# Altium schematic sheet DC_DC_MPPT.SchDoc
size A4; SheetNumber: 3; SheetTotal: 9
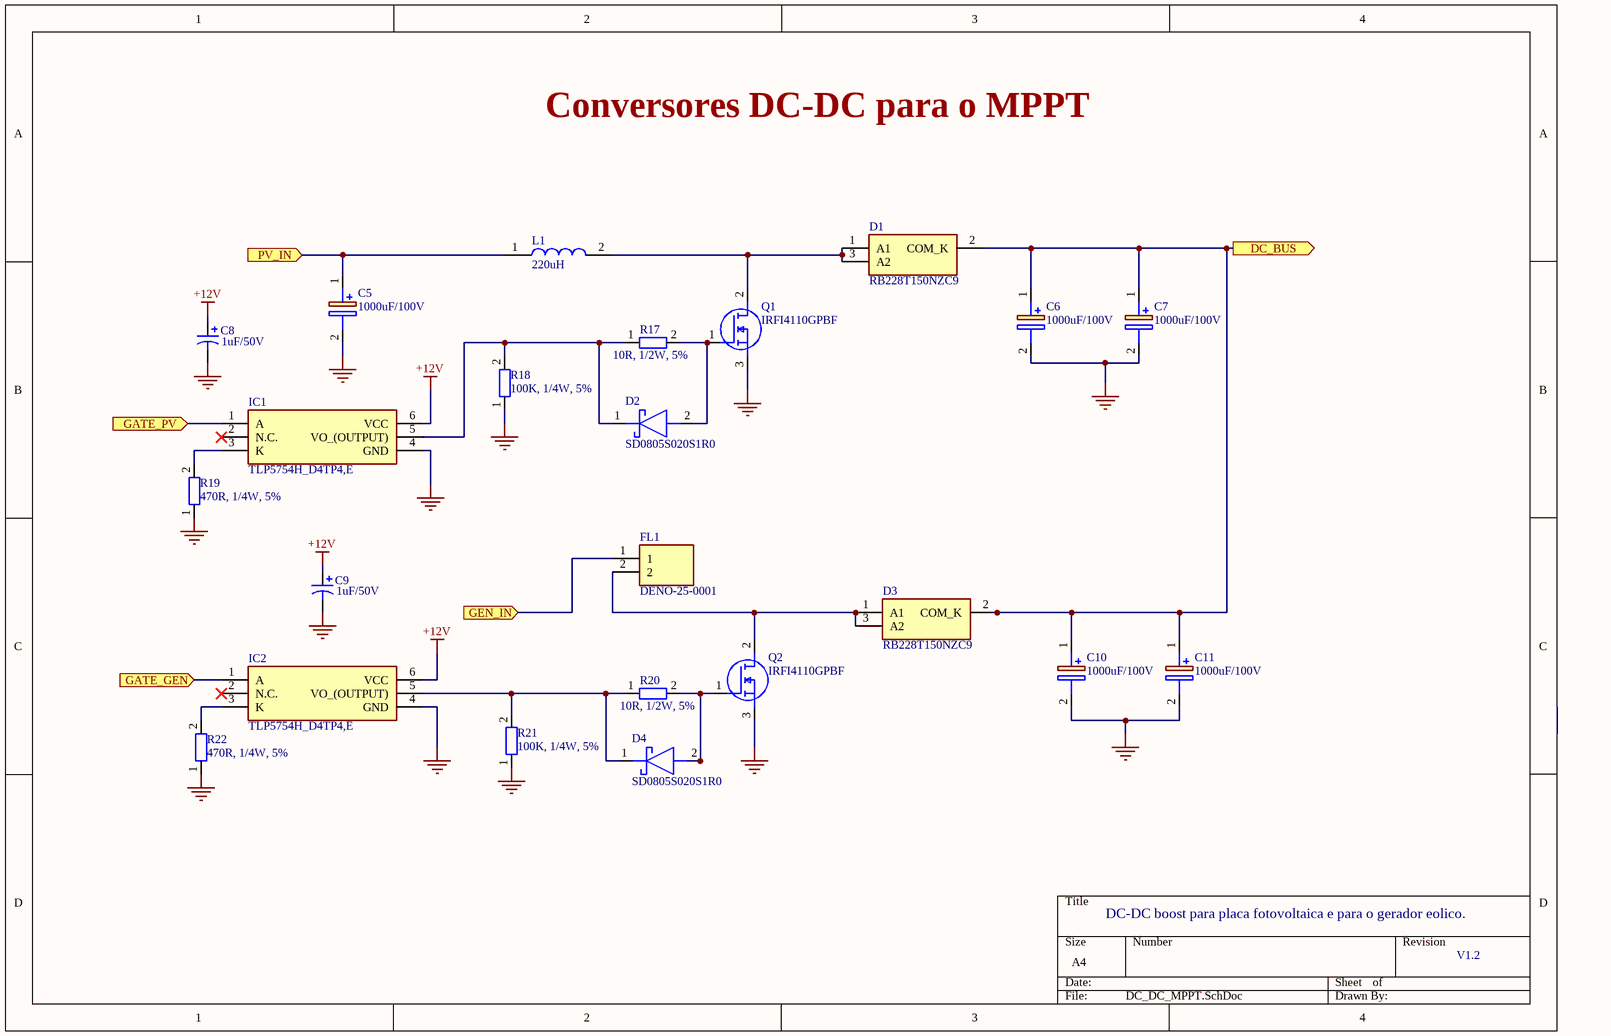
[diagram p0: DC_DC_MPPT.SchDoc]

## Parts
C5  1000uF/100V  [CAPPRD750W85D1800H3750]
C6  1000uF/100V  [CAPPRD750W85D1800H3750]
C7  1000uF/100V  [CAPPRD750W85D1800H3750]
C8  value 1uF/50V  [C1206]  (hidden comment: Cap Pol1)
C9  value 1uF/50V  [C1206]  (hidden comment: Cap Pol1)
C10  1000uF/100V  [CAPPRD750W85D1800H3750]
C11  1000uF/100V  [CAPPRD750W85D1800H3750]
D1  RB228T150NZC9  [TO254P480X1010X2100-3P]
D2  SD0805S020S1R0  [DIOM1613X100N]
D3  RB228T150NZC9  [TO254P480X1010X2100-3P]
D4  SD0805S020S1R0  [DIOM1613X100N]
FL1  DENO-25-0001  [DENO250001]
IC1  TLP5754H_D4TP4,E  [SOIC127P1105X230-6N]
IC2  TLP5754H_D4TP4,E  [SOIC127P1105X230-6N]
L1  220uH  [1140221KRC]
Q1  IRFI4110GPBF  [TO254P483X1018X2095-3P]
Q2  IRFI4110GPBF  [TO254P483X1018X2095-3P]
R17  10R, 1/2W, 5%  [RESC3216X60N]
R18  100K, 1/4W, 5%  [RES-0805]
R19  470R, 1/4W, 5%  [RES-0805]
R20  10R, 1/2W, 5%  [RESC3216X60N]
R21  100K, 1/4W, 5%  [RES-0805]
R22  470R, 1/4W, 5%  [RES-0805]

## Ports
DC_BUS (out), GATE_GEN (in), GATE_PV (in), GEN_IN (in), PV_IN (in)

## Nets
+12V: C8.1 C9.1 IC1.6(VCC) IC2.6(VCC)
GND: C5.2(-) C6.2(-) C7.2(-) C8.2 C9.2 C10.2(-) C11.2(-) IC1.4(GND) IC2.4(GND) Q1.3(S) Q2.3(S) R18.1 R19.1 R21.1 R22.1
DC_BUS: C6.1(+) C7.1(+) C10.1(+) C11.1(+) D1.2(COM_K) D3.2(COM_K) ; port DC_BUS
GATE_GEN: IC2.1(A) ; port GATE_GEN
GATE_PV: IC1.1(A) ; port GATE_PV
GEN_IN: FL1.1 ; port GEN_IN
PV_IN: C5.1(+) L1.1 ; port PV_IN
NetD1_1: D1.1(A1) D1.3(A2) L1.2 Q1.2(D)
NetD2_1: D2.1(K) IC1.5(VO_(OUTPUT)) R17.1 R18.2
NetD2_2: D2.2(A) Q1.1(G) R17.2
NetD3_1: D3.1(A1) D3.3(A2) FL1.2 Q2.2(D)
NetD4_1: D4.1(K) IC2.5(VO_(OUTPUT)) R20.1 R21.2
NetD4_2: D4.2(A) Q2.1(G) R20.2
NetIC1_3: IC1.3(K) R19.2
NetIC2_3: IC2.3(K) R22.2

Not connected (* = marked no-connect by the designer): IC1 2(N.C.)*; IC2 2(N.C.)*

## Notes on the sheet
- Conversores DC-DC para o MPPT
- DC-DC boost para placa fotovoltaica e para o gerador eolico.
- V1.2

## Library data of the parts
C5-C7 C10 C11 = ECA-2AHG102: Aluminum Electrolytic Capacitors - Leaded 1000uF 100V; Manufacturer_Name: Panasonic; Capacitance: 1mF; Tolerance: 20%; Ripple Current: 985mA; Leakage Current: 3uA; Life (Hours): 2000Hour; Dissipation Factor: 0.08%; Lead/Base Style: Straight; Lead Diameter: 0.8mm; Datasheet Link: http://www.mouser.com/ds/2/315/ABA0000C1215-1109177.pdf; Height: 37.5mm; Manufacturer_Part_Number: ECA-2AHG102; Mouser Part Number: 667-ECA-2AHG102; Mouser Price/Stock: https://www.mouser.co.uk/ProductDetail/Panasonic/ECA-2AHG102/?qs=rrcJgg%2Fw9KxYcZZHtVYgiQ%3D%3D; Arrow Part Number: ECA-2AHG102; Arrow Price/Stock: https://www.arrow.com/en/products/eca-2ahg102/panasonic; Supplier 1: Mouser; Supplier Part Number 1: 667-ECA-2AHG102; Manufacturer: Panasonic; Manufacturer Part Number: ECA-2AHG102; RoHS: Yes; Category: Aluminum Electrolytic Capacitors; Stock 1: 994; Pricing 1: 1=2.62000, 10=1.75000, 50=1.75000, 100=1.60000, 1000=1.07000, 10000=1.07000 (USD); Mount: Through Hole,PCB; Case/Package: Radial; Number of Pins: 2; Contact Plating: Tin; Min Operating Temperature: -55°C; Max Operating Temperature: 105°C; Termination: Radial; Voltage Rating: 100V; Packaging: Bulk; Package Quantity: 50; Voltage Rating (DC): 100V; Voltage: 100V; Series: NHG; Construction: RADIAL; Diameter: 18mm; Length: 35.5mm; Width: 18mm; Lead Pitch: 7.5mm; Height - Seated (Max): 1.476inch; Radiation Hardening: No; REACH SVHC: No SVHC; Lead Free: Lead Free; RoHS Compliant: Yes; ComponentLink1URL: https://datasheet.ciiva.com/2984/aba0000ce26-2984390.pdf?src-supplier=Avnet; ComponentLink1Description: https://datasheet.ciiva.com/2984/aba0000ce26-2984390.pdf?src-supplier=Avnet; ComponentLink2URL: https://datasheet.ciiva.com/43459/1790596-43459676.pdf?src-supplier=Farnell; ComponentLink2Description: https://datasheet.ciiva.com/43459/1790596-43459676.pdf?src-supplier=Farnell; ComponentLink3URL: https://datasheet.ciiva.com/24027/aba0000ce26-372437-24027279.pdf?src-supplier=Mouser; ComponentLink3Description: https://datasheet.ciiva.com/24027/aba0000ce26-372437-24027279.pdf?src-supplier=Mouser; ComponentLink4URL: https://datasheet.ciiva.com/30158/8aba0000ce26-30158524.pdf?src-supplier=Onlinecomponents.com; ComponentLink4Description: https://datasheet.ciiva.com/30158/8aba0000ce26-30158524.pdf?src-supplier=Onlinecomponents.com; ComponentLink5URL: https://datasheet.ciiva.com/16387/aba0000ce26-16387053.pdf?src-supplier=Future+Electronics; ComponentLink5Description: https://datasheet.ciiva.com/16387/aba0000ce26-16387053.pdf?src-supplier=Future+Electronics; ComponentLink6URL: https://datasheet.ciiva.com/14594/70067776-14594090.pdf?src-supplier=Allied+Electronics; ComponentLink6Description: https://datasheet.ciiva.com/14594/70067776-14594090.pdf?src-supplier=Allied+Electronics; ComponentLink7URL: https://datasheet.ciiva.com/15198/getdatasheetpartid-470872-15198006.pdf?src-supplier=Verical; ComponentLink7Description: https://datasheet.ciiva.com/15198/getdatasheetpartid-470872-15198006.pdf?src-supplier=Verical; ComponentLink8URL: https://datasheet.ciiva.com/17533/aba0000ce26-17533421.pdf?src-supplier=Avnet+Europe; ComponentLink8Description: https://datasheet.ciiva.com/17533/aba0000ce26-17533421.pdf?src-supplier=Avnet+Europe; ComponentLink9URL: https://datasheet.ciiva.com/29248/792491-da-01-en-elko-nhg-r-1000uf-100v-105c-29248620.pdf?src-supplier=Conrad; ComponentLink9Description: https://datasheet.ciiva.com/29248/792491-da-01-en-elko-nhg-r-1000uf-100v-105c-29248620.pdf?src-supplier=Conrad
C8 C9 = Cap Pol1: KEMET         T491A105K050AT            Surface Mount Tantalum Capacitor, T491 Series, 1 F,  10%, 50 V, 1206 [3216 Metric], A; Capacitance: 1uF; ESR (Equivalent Series Resistance): 7R; Voltage Rating: 50V; Polarity: Polar; Dissipation Factor: 4%; Published: 8-Jun-2000; LatestRevisionDate: 17-Jul-2002; LatestRevisionNote: Re-released for DXP Platform.; PackageReference: RB7.6-15; Publisher: Altium Limited; PackageDescription: Polarized Capacitor (Radial); 2 Leads; Supplier 1: Mouser; Supplier Part Number 1: 80-T491A105K050AT; Manufacturer: KEMET; Manufacturer Part Number: T491A105K050AT; RoHS: Yes; Category: Tantalum Capacitors; Stock 1: 5526; Pricing 1: 1=0.86000, 10=0.53600, 50=0.53600, 100=0.37800, 1000=0.31600, 10000=0.24700 (USD); Case/Package: Molded; Case Code (Metric): 3216; Case Code (Imperial): 1206; Min Operating Temperature: -55°C; Max Operating Temperature: 125°C; Tolerance: 10%; Packaging: Cut Tape; Voltage Rating (DC): 50V; Length: 3.2mm; Depth: 1.6mm; REACH SVHC: No SVHC; Lead Free: Lead Free; RoHS Compliant: Yes; ComponentLink1URL: https://datasheet.ciiva.com/7972/1854511-7972911.pdf?src-supplier=Element14; ComponentLink1Description: https://datasheet.ciiva.com/7972/1854511-7972911.pdf?src-supplier=Element14
D1 D3 = RB228T150NZC9: Schottky Diode; Manufacturer_Name: ROHM Semiconductor; Manufacturer: Rohm; Datasheet Link: https://fscdn.rohm.com/en/products/databook/datasheet/discrete/diode/schottky_barrier/rb228t150nz-e.pdf; Height: 4.8mm; Manufacturer_Part_Number: RB228T150NZC9; Supplier 1: Mouser; Supplier Part Number 1: 755-RB228T150NZC9; Manufacturer Part Number: RB228T150NZC9; RoHS: Yes; Stock 1: 962; Pricing 1: 1=1.74000, 10=1.48000, 50=1.48000, 100=1.14000, 1000=0.82400, 10000=0.78200 (USD)
D2 D4 = SD0805S020S1R0: Schottky Diodes & Rectifiers 20volts 1A SIZE 0805; Manufacturer_Name: AVX; Manufacturer: Kyocera AVX; Max Surge Current: 10A; Forward Voltage: 450mV; Max Reverse Current: 200uA; Max Repetitive Reverse Voltage (Vrrm): 20V; Element Configuration: Single; Datasheet Link: https://componentsearchengine.com/Datasheets/1/SD0805S020S1R0.pdf; Height: 1mm; Manufacturer_Part_Number: SD0805S020S1R0; Mouser Part Number: 581-SD0805S020S1R0; Mouser Price/Stock: https://www.mouser.co.uk/ProductDetail/AVX/SD0805S020S1R0/?qs=jCA%252BPfw4LHbpkAoSnwrdjw%3D%3D; Arrow Part Number: SD0805S020S1R0; Arrow Price/Stock: https://www.arrow.com/en/products/sd0805s020s1r0/avx; Supplier 1: Mouser; Supplier Part Number 1: 581-SD0805S020S1R0; Manufacturer Part Number: SD0805S020S1R0; RoHS: Yes; Category: Rectifier Diodes; Stock 1: 14821; Pricing 1: 1=0.38000, 10=0.29100, 50=0.29100, 100=0.17800, 1000=0.11300, 10000=0.08700 (USD); Mount: Surface Mount; Case/Package: 0805; Number of Pins: 2; Case Code (Metric): 2012; Case Code (Imperial): 0805; Min Operating Temperature: -55°C; Max Operating Temperature: 125°C; Packaging: Tape and Reel; Package Quantity: 3000; Forward Current: 1A; Average Rectified Current: 1A; Max Reverse Leakage Current: 200uA; Max Forward Surge Current (Ifsm): 10A; Peak Non-Repetitive Surge Current: 10A; Max Reverse Voltage (DC): 20V; Series: -; Radiation Hardening: No; REACH SVHC: No SVHC; RoHS Compliant: Yes; ComponentLink1URL: https://datasheet.ciiva.com/29883/schottky-29883740.pdf?src-supplier=Avnet; ComponentLink1Description: https://datasheet.ciiva.com/29883/schottky-29883740.pdf?src-supplier=Avnet; ComponentLink2URL: https://datasheet.ciiva.com/29883/schottky-29883741.pdf?src-supplier=Avnet; ComponentLink2Description: https://datasheet.ciiva.com/29883/schottky-29883741.pdf?src-supplier=Avnet; ComponentLink3URL: https://datasheet.ciiva.com/13084/schottky-221155-13084174.pdf?src-supplier=Mouser; ComponentLink3Description: https://datasheet.ciiva.com/13084/schottky-221155-13084174.pdf?src-supplier=Mouser
FL1 = DENO-25-0001: Fixed Inductors DENO Grnd wire choke 16A; Manufacturer_Name: SCHURTER; DC Resistance (DCR): 27mR; Inductance: 4mH; Lead/Base Style: Radial; Self Resonant Frequency: 300kHz; Shielding: Unshielded; Number of Lines: 1; Lead Diameter: 1.12mm; Datasheet Link: https://www.mouser.com/datasheet/2/358/typ_DENO-1276019.pdf; Height: 25mm; Manufacturer_Part_Number: DENO-25-0001; Mouser Part Number: 693-DENO-25-0001; Mouser Price/Stock: https://www.mouser.co.uk/ProductDetail/Schurter/DENO-25-0001?qs=A5k8bsa1loDfpdVSyZOXZg%3D%3D; Arrow Part Number: DENO-25-0001; Arrow Price/Stock: https://www.arrow.com/en/products/deno-25-0001/schurter; Supplier 1: Mouser; Supplier Part Number 1: 693-DENO-25-0001; Manufacturer: Schurter; Manufacturer Part Number: DENO-25-0001; RoHS: Yes; Category: Fixed Inductors; Stock 1: 326; Pricing 1: 1=4.79000, 10=4.25000, 50=3.83000, 100=3.62000, 1000=2.98000, 10000=2.87000 (USD); Mount: Through Hole,Radial; Case/Package: Radial; Weight: 0.83952oz; Min Operating Temperature: -25°C; Max Operating Temperature: 100°C; Max DC Current: 16A; Package Quantity: 50; Current Rating: 16A; Packaging: Bulk; Max Current Rating: 16A; DC Current: 16A; Termination: Radial; Series: DENO; Diameter: 25mm; Length: 0.984inch; Width: 0.709inch; Depth: 18mm; Radiation Hardening: No; Military Standard: Not; Lead Free: Lead Free; RoHS Compliant: Yes; ComponentLink1URL: https://datasheet.ciiva.com/25456/1832736-25456284.pdf?src-supplier=Newark; ComponentLink1Description: https://datasheet.ciiva.com/25456/1832736-25456284.pdf?src-supplier=Newark; ComponentLink2URL: https://datasheet.ciiva.com/17249/typ-deno-17249423.pdf?src-supplier=Avnet+Europe; ComponentLink2Description: https://datasheet.ciiva.com/17249/typ-deno-17249423.pdf?src-supplier=Avnet+Europe; ComponentLink3URL: https://datasheet.ciiva.com/6708/typ-deno-6708408.pdf?src-supplier=Digi-Key; ComponentLink3Description: https://datasheet.ciiva.com/6708/typ-deno-6708408.pdf?src-supplier=Digi-Key
IC1 IC2 = TLP5754H_D4TP4,E: Integrated Circuit; Manufacturer_Name: Toshiba; Manufacturer_Part_Number: TLP5754H(D4TP4,E; Datasheet Link: https://toshiba.semicon-storage.com/; Height: 2.3mm; Mouser Part Number: 757-TLP5754HD4TP4E; Mouser Price/Stock: https://www.mouser.co.uk/ProductDetail/Toshiba/TLP5754HD4TP4E?qs=BJlw7L4Cy78tX5u9MwNqOg%3D%3D; Supplier 1: Mouser; Supplier Part Number 1: 757-TLP5754HD4TP4E; Manufacturer: Toshiba; Manufacturer Part Number: TLP5754H(D4TP4,E; RoHS: Yes; Stock 1: 2749; Pricing 1: 1=2.13000, 10=1.86000, 50=1.83000, 100=1.09000, 1000=0.95600, 10000=0.73200 (USD)
L1 = 1140-221K-RC: BOURNS JW MILLER         1140-221K-RC             HIGH CURRENT CHOKE, 220UH 11.4A 10%; Core Material: Ferrite; Current Rating: 7.4A; Shielding: Unshielded; Saturation Current: 14A; DC Resistance (DCR): 50mR; Test Frequency: 1kHz; Lead/Base Style: Radial; Lead Diameter: 0.057inch; Lead Length: 12.7mm; Datasheet Link: https://www.mouser.com/datasheet/2/54/1140_series-776825.pdf; Height: 26.162mm; Manufacturer_Name: Bourns; Manufacturer_Part_Number: 1140-221K-RC; Mouser Part Number: 542-1140-221K-RC; Mouser Price/Stock: https://www.mouser.co.uk/ProductDetail/Bourns/1140-221K-RC?qs=Pac2tMOelJAp1Q7rw4D2Wg%3D%3D; Arrow Part Number: 1140-221K-RC; Arrow Price/Stock: https://www.arrow.com/en/products/1140-221k-rc/bourns; Supplier 1: Mouser; Manufacturer: Bourns JW Miller; Manufacturer Part Number: 1140-221K-RC; RoHS: Yes; Category: Fixed Inductors; Stock 1: 476; Pricing 1: 1=8.31000, 10=7.34000, 50=6.41000, 100=6.21000, 1000=5.66000, 10000=5.66000 (USD); Mount: Through Hole; Case/Package: Radial; Contact Plating: Tin; Min Operating Temperature: -55°C; Max Operating Temperature: 105°C; Packaging: Bulk; Tolerance: 10%; Inductance Tolerance: 10%; Package Quantity: 70; Resistor Type: Wirewound; Inductance: 220uH; Max DC Current: 11.4A; Termination: Radial; DC Current: 11.4A; RMS Current (Irms): 7.4A; Series: 1140; Diameter: 1.5inch; Length: 1.03inch; Lead Pitch: 29.21mm; Height - Seated (Max): 1.03inch; REACH SVHC: No SVHC; Military Standard: Not; Lead Free: Lead Free; ComponentLink1URL: https://datasheet.ciiva.com/13283/1140-series-61680-13283934.pdf?src-supplier=Mouser; ComponentLink1Description: https://datasheet.ciiva.com/13283/1140-series-61680-13283934.pdf?src-supplier=Mouser; ComponentLink2URL: https://datasheet.ciiva.com/5839/1140-series-5839095.pdf?src-supplier=Farnell; ComponentLink2Description: https://datasheet.ciiva.com/5839/1140-series-5839095.pdf?src-supplier=Farnell; ComponentLink3URL: https://datasheet.ciiva.com/6690/1140-series-6690681.pdf?src-supplier=Digi-Key; ComponentLink3Description: https://datasheet.ciiva.com/6690/1140-series-6690681.pdf?src-supplier=Digi-Key; ComponentLink4URL: https://datasheet.ciiva.com/30231/8931140-series-30231343.pdf?src-supplier=Onlinecomponents.com; ComponentLink4Description: https://datasheet.ciiva.com/30231/8931140-series-30231343.pdf?src-supplier=Onlinecomponents.com; ComponentLink5URL: https://datasheet.ciiva.com/1474/1140-series-1474528.pdf?src-supplier=Element14; ComponentLink5Description: https://datasheet.ciiva.com/1474/1140-series-1474528.pdf?src-supplier=Element14; Supplier Part Number 1: 542-1140-221K-RC
Q1 Q2 = IRFI4110GPBF: MOSFET N-CH 100V 72A TO220AB; Manufacturer_Name: Infineon; Rds On Max: 4.5mR; Input Capacitance: 9.54nF; Max Power Dissipation: 61W; Threshold Voltage: 4V; Datasheet Link: https://www.mouser.co.uk/datasheet/2/196/Infineon-IRFI4110G-DS-v01_02-EN-1227339.pdf; Height: 4.83mm; Manufacturer_Part_Number: IRFI4110GPBF; Mouser Part Number: 942-IRFI4110GPBF; Mouser Price/Stock: https://www.mouser.com/Search/Refine.aspx?Keyword=942-IRFI4110GPBF; Arrow Part Number: IRFI4110GPBF; Arrow Price/Stock: https://www.arrow.com/en/products/irfi4110gpbf/infineon-technologies-ag; Supplier 1: Mouser; Supplier Part Number 1: 942-IRFI4110GPBF; Manufacturer: Infineon; Manufacturer Part Number: IRFI4110GPBF; RoHS: Yes; Category: MOSFETs; Stock 1: 2175; Pricing 1: 1=3.400000, 10=2.890000, 100=2.310000, 500=2.060000, 1000=1.840000, 2000=1.840000 (USD); Mount: Through Hole; Case/Package: TO-220-3; Number of Pins: 3; Min Operating Temperature: -55°C; Max Operating Temperature: 175°C; Continuous Drain Current (ID): 72A; Packaging: Rail/Tube; Drain to Source Voltage (Vdss): 100V; Max Dual Supply Voltage: 100V; REACH SVHC: No SVHC; Lead Free: Lead Free; RoHS Compliant: Yes; Halogen Free: Halogen Free; ComponentLink1URL: http://www.infineon.com/dgdl/irfi4110gpbf.pdf?fileId=5546d462533600a401535623f28d1f78&src-supplier=Digi-Key; ComponentLink1Description: http://www.infineon.com/dgdl/irfi4110gpbf.pdf?fileId=5546d462533600a401535623f28d1f78&src-supplier=Digi-Key; ComponentLink2URL: http://www.farnell.com/datasheets/1302157.pdf?src-supplier=Element14; ComponentLink2Description: http://www.farnell.com/datasheets/1302157.pdf?src-supplier=Element14
R17 R20 = RES-1206: Res Thick Film 0805 10 Ohm 5% 0.5W(1/2W) +/-200ppm/C Pad SMD Automotive T/R; Manufacturer: Vishay Dale; Manufacturer Part Number: CRCW080510R0JNEAHP; Temperature Coefficient: 200ppm/°C; Power Rating: 330mW; Voltage Rating: 150V; Max Power Dissipation: 333mW; Supplier 1: Mouser; Supplier Part Number 1: 71-CRCW080510R0JNEAH; RoHS: Yes; Category: Chip SMD Resistors; Stock 1: 4777; Pricing 1: 1=0.23000, 10=0.20300, 50=0.20300, 100=0.07900, 1000=0.03000, 10000=0.02700 (USD); Mount: Surface Mount; Case/Package: 0805; Contact Plating: Tin; Weight: 0.000194oz; Case Code (Metric): 2012; Case Code (Imperial): 0805; Min Operating Temperature: -55°C; Max Operating Temperature: 155°C; Resistance: 10R; Tolerance: 5%; Resistor Type: Thick Film; Packaging: Tape and Reel; Package Quantity: 1; Number of Terminations: 2; Features: Automotive AEC-Q200; Series: CRCW-HP; Construction: Rectangular; Length: 2mm; Width: 0.049inch; Height: 0.024inch; Depth: 1.25mm; Radiation Hardening: No; Military Standard: Not; Lead Free: Lead Free; RoHS Compliant: Yes; ComponentLink1URL: https://datasheet.ciiva.com/2499/crcwhpe3-2499490.pdf?src-supplier=Digi-Key; ComponentLink1Description: https://datasheet.ciiva.com/2499/crcwhpe3-2499490.pdf?src-supplier=Digi-Key; ComponentLink2URL: https://datasheet.ciiva.com/2499/crcwhpe3-2499491.pdf?src-supplier=Digi-Key; ComponentLink2Description: https://datasheet.ciiva.com/2499/crcwhpe3-2499491.pdf?src-supplier=Digi-Key; ComponentLink3URL: https://datasheet.ciiva.com/2499/crcwhpe3-2499492.pdf?src-supplier=Digi-Key; ComponentLink3Description: https://datasheet.ciiva.com/2499/crcwhpe3-2499492.pdf?src-supplier=Digi-Key; ComponentLink4URL: https://datasheet.ciiva.com/5562/crcwhpe3-46056-5562181.pdf?src-supplier=Mouser; ComponentLink4Description: https://datasheet.ciiva.com/5562/crcwhpe3-46056-5562181.pdf?src-supplier=Mouser; ComponentLink5URL: https://datasheet.ciiva.com/9050/crcwhpe3-9050566.pdf?src-supplier=Avnet; ComponentLink5Description: https://datasheet.ciiva.com/9050/crcwhpe3-9050566.pdf?src-supplier=Avnet
R18 R21 = Res-0805: Thick Film Resistors 100K OHM 1%; Manufacturer_Name: YAGEO (PHYCOMP); Manufacturer_Part_Number: RC0805JR-131KL; Manufacturer: Yageo; Manufacturer Part Number: RC0805FR-13100KL; Resistance: 100kR; Temperature Coefficient: 100ppm/°C; Power Rating: 125mW; Voltage Rating: 150V; Datasheet Link: http://www.yageo.com/documents/recent/PYu-RC_Group_51_RoHS_L_10.pdf; Height: 0.6mm; Mouser Part Number: 603-RC0805JR-131KL; Mouser Price/Stock: https://www.mouser.com/Search/Refine.aspx?Keyword=603-RC0805JR-131KL; Supplier 1: Mouser; Supplier Part Number 1: 603-RC0805FR-13100KL; RoHS: Yes; Category: Chip SMD Resistors; Stock 1: 57591; Pricing 1: 1=0.13000, 10=0.03100, 50=0.03100, 100=0.01100, 1000=0.00800, 10000=0.00500 (USD); Case/Package: 0805; Contact Plating: Tin,Lead,Matte; Case Code (Imperial): 0805; Case Code (Metric): 2012; Size Code: 0805; Min Operating Temperature: -55°C; Max Operating Temperature: 155°C; Tolerance: 1%; Resistor Type: Thick Film; Packaging: Tape and Reel; Termination: SMD/SMT; Series: RC; Radiation Hardening: No; Lead Free: Lead Free; RoHS Compliant: Yes; ComponentLink1URL: https://datasheet.ciiva.com/5558/rc0805-5558047.pdf?src-supplier=Mouser; ComponentLink1Description: https://datasheet.ciiva.com/5558/rc0805-5558047.pdf?src-supplier=Mouser
R19 R22 = Res-0805: Thick Film Resistors - SMD 470 OHM 5%; Manufacturer_Name: YAGEO (PHYCOMP); Manufacturer_Part_Number: RC0805JR-131KL; Manufacturer: Yageo; Manufacturer Part Number: RC0805JR-13470RL; Temperature Coefficient: 100ppm/°C; Power Rating: 125mW; Voltage Rating: 150V; Datasheet Link: http://www.yageo.com/documents/recent/PYu-RC_Group_51_RoHS_L_10.pdf; Height: 0.6mm; Mouser Part Number: 603-RC0805JR-131KL; Mouser Price/Stock: https://www.mouser.com/Search/Refine.aspx?Keyword=603-RC0805JR-131KL; Supplier 1: Mouser; Supplier Part Number 1: 603-RC0805JR-13470RL; RoHS: Yes; Category: Chip SMD Resistors; Stock 1: 48513; Pricing 1: 1=0.12000, 10=0.01700, 50=0.01700, 100=0.00600, 1000=0.00500, 10000=0.00400 (USD); Case/Package: 0805; Contact Plating: Tin,Matte; Case Code (Imperial): 0805; Case Code (Metric): 2012; Min Operating Temperature: -55°C; Max Operating Temperature: 155°C; Resistance: 470R; Tolerance: 5%; Resistor Type: Thick Film; Packaging: Tape and Reel; Termination: SMD/SMT; Series: RC; Construction: Rectangular; Length: 2mm; Width: 1.25mm; Depth: 1.25mm; Radiation Hardening: No; Military Standard: Not; RoHS Compliant: Yes; ComponentLink1URL: http://www.mouser.com/ds/2/447/Yageo_08112016_RC0805-968729.pdf?src-supplier=Mouser; ComponentLink1Description: http://www.mouser.com/ds/2/447/Yageo_08112016_RC0805-968729.pdf?src-supplier=Mouser; ComponentLink2URL: http://components.arrow.com/part/dataview/0323_04018308?src-supplier=Arrow+Europe; ComponentLink2Description: http://components.arrow.com/part/dataview/0323_04018308?src-supplier=Arrow+Europe; ComponentLink3URL: http://www.yageo.com/documents/recent/PYu-RC0805_51_RoHS_L-(4).pdf?src-supplier=Avnet+Europe; ComponentLink3Description: http://www.yageo.com/documents/recent/PYu-RC0805_51_RoHS_L-(4).pdf?src-supplier=Avnet+Europe